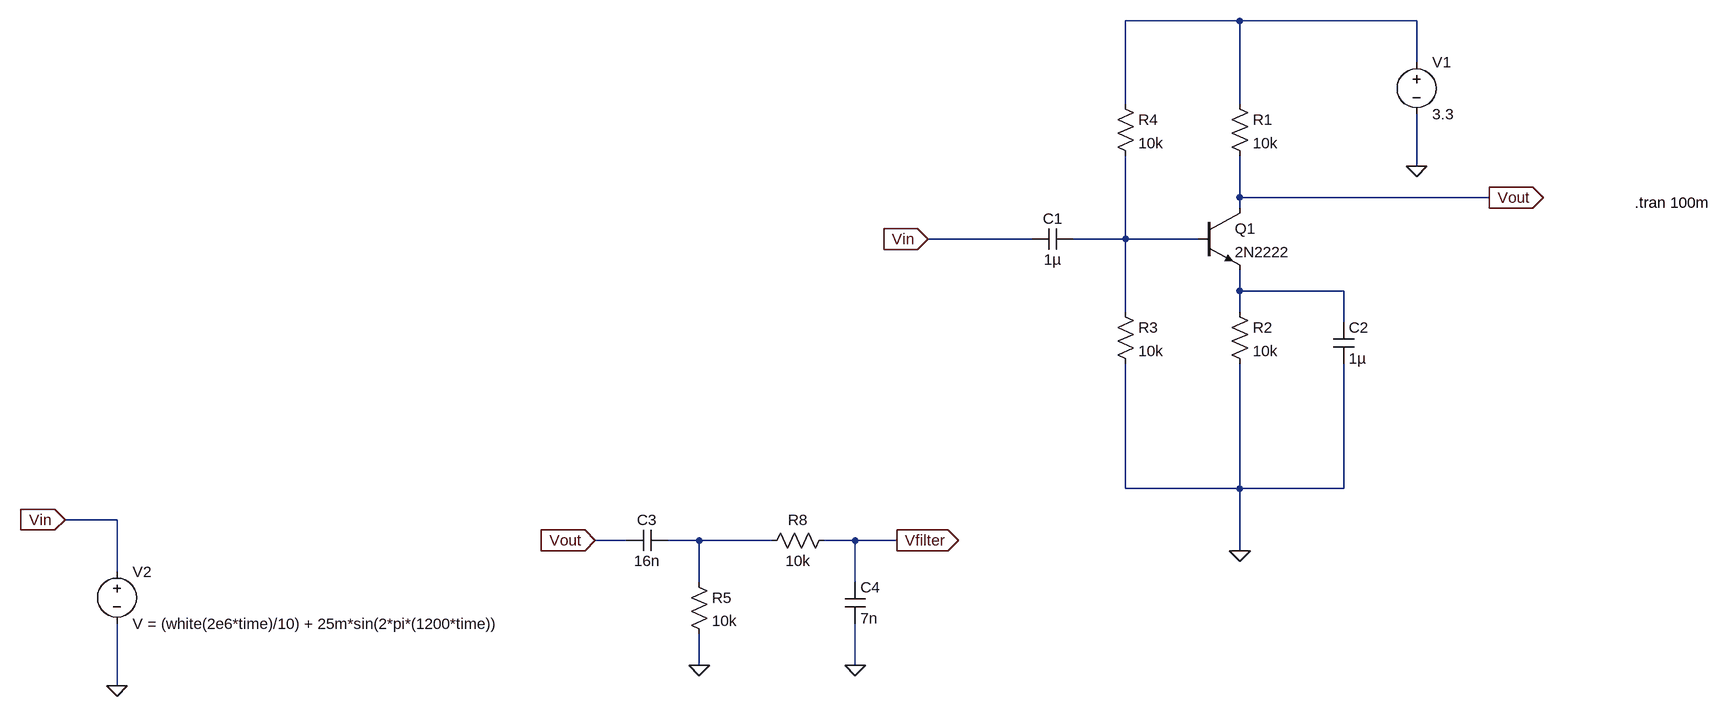
[diagram p0: schematic Rx_circuit.asc]
Rx_circuit.asc, the LTspice schematic file:
Version 4
SHEET 1 1096 804
WIRE 80 -240 -96 -240
WIRE 352 -240 80 -240
WIRE 352 -176 352 -240
WIRE -96 -112 -96 -240
WIRE 80 -112 80 -240
WIRE 352 -16 352 -96
WIRE 80 32 80 -32
WIRE 464 32 80 32
WIRE 80 48 80 32
WIRE -240 96 -400 96
WIRE -96 96 -96 -32
WIRE -96 96 -176 96
WIRE 16 96 -96 96
WIRE 80 176 80 144
WIRE 240 176 80 176
WIRE -96 208 -96 96
WIRE 80 208 80 176
WIRE 240 224 240 176
WIRE -96 480 -96 288
WIRE 80 480 80 288
WIRE 80 480 -96 480
WIRE 240 480 240 288
WIRE 240 480 80 480
WIRE -1648 528 -1728 528
WIRE -864 560 -912 560
WIRE -752 560 -800 560
WIRE -640 560 -752 560
WIRE -512 560 -560 560
WIRE -448 560 -512 560
WIRE 80 576 80 480
WIRE -1648 608 -1648 528
WIRE -752 624 -752 560
WIRE -512 624 -512 560
WIRE -752 752 -752 704
WIRE -512 752 -512 688
WIRE -1648 784 -1648 688
FLAG 352 -16 0
FLAG 80 576 0
FLAG -1648 784 0
FLAG 464 32 Vout
IOPIN 464 32 Out
FLAG -1728 528 Vin
IOPIN -1728 528 In
FLAG -752 752 0
FLAG -512 752 0
FLAG -912 560 Vout
IOPIN -912 560 In
FLAG -448 560 Vfilter
IOPIN -448 560 Out
FLAG -400 96 Vin
IOPIN -400 96 In
DATAFLAG -480 560 ""
SYMBOL npn 16 48 R0
SYMATTR InstName Q1
SYMATTR Value 2N2222
SYMBOL res 64 -128 R0
SYMATTR InstName R1
SYMATTR Value 10k
SYMBOL res 64 192 R0
SYMATTR InstName R2
SYMATTR Value 10k
SYMBOL res -112 192 R0
SYMATTR InstName R3
SYMATTR Value 10k
SYMBOL res -112 -128 R0
SYMATTR InstName R4
SYMATTR Value 10k
SYMBOL cap 224 224 R0
SYMATTR InstName C2
SYMATTR Value 1µ
SYMBOL cap -176 80 R90
WINDOW 0 0 32 VBottom 2
WINDOW 3 32 32 VTop 2
SYMATTR InstName C1
SYMATTR Value 1µ
SYMBOL voltage 352 -192 R0
WINDOW 123 0 0 Left 0
WINDOW 39 0 0 Left 0
SYMATTR InstName V1
SYMATTR Value 3.3
SYMBOL voltage -1648 592 R0
SYMATTR InstName V2
SYMATTR Value V = (white(2e6*time)/10) + 25m*sin(2*pi*(1200*time))
SYMATTR Prefix B
SYMBOL cap -800 544 R90
WINDOW 0 0 32 VBottom 2
WINDOW 3 32 32 VTop 2
SYMATTR InstName C3
SYMATTR Value 16n
SYMBOL res -768 608 R0
SYMATTR InstName R5
SYMATTR Value 10k
SYMBOL res -544 544 R90
WINDOW 0 0 56 VBottom 2
WINDOW 3 32 56 VTop 2
SYMATTR InstName R8
SYMATTR Value 10k
SYMBOL cap -528 624 R0
SYMATTR InstName C4
SYMATTR Value 7n
TEXT 688 40 Left 2 !.tran 100m

The netlist it stands for:
* Rx_circuit.asc
Q1 Vout N002 N003 0 2N2222
R1 N001 Vout 10k
R2 N003 0 10k
R3 N002 0 10k
R4 N001 N002 10k
C2 N003 0 1µ
C1 N002 Vin 1µ
V1 N001 0 3.3
B§V2 Vin 0 V = (white(2e6*time)/10) + 25m*sin(2*pi*(1200*time))
C3 N004 Vout 16n
R5 N004 0 10k
R8 Vfilter N004 10k
C4 Vfilter 0 7n
.model NPN NPN
.model PNP PNP
.lib standard.bjt
.tran 100m
.backanno
.end